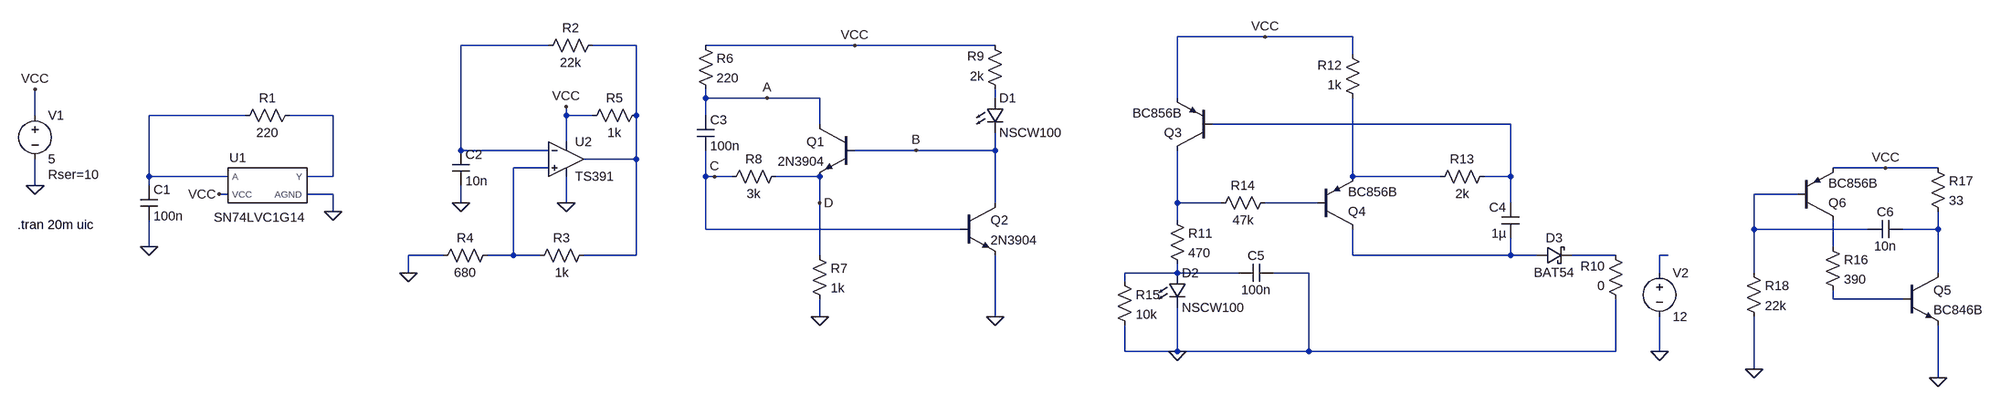
[diagram p0: schematic relaxation_oscillator.asc]
relaxation_oscillator.asc, the LTspice schematic file:
Version 4
SHEET 1 3896 1076
WIRE 2128 -80 1968 -80
WIRE 2288 -80 2128 -80
WIRE 784 -64 624 -64
WIRE 944 -64 864 -64
WIRE 1376 -64 1104 -64
WIRE 1632 -64 1376 -64
WIRE 2288 -48 2288 -80
WIRE 1104 32 1104 16
WIRE 1216 32 1104 32
WIRE 1312 32 1216 32
WIRE 1632 32 1632 16
WIRE 1968 32 1968 -80
WIRE -160 64 -160 16
WIRE 224 64 48 64
WIRE 384 64 304 64
WIRE 816 64 816 48
WIRE 864 64 816 64
WIRE 944 64 944 -64
WIRE 1104 64 1104 32
WIRE 1312 80 1312 32
WIRE 2576 80 2032 80
WIRE 816 112 816 64
WIRE 624 128 624 -64
WIRE 784 128 624 128
WIRE 1488 128 1376 128
WIRE 1632 128 1632 96
WIRE 1632 128 1488 128
WIRE 944 144 944 64
WIRE 944 144 848 144
WIRE 784 160 720 160
WIRE 3712 160 3616 160
WIRE 3808 160 3712 160
WIRE 48 176 48 64
WIRE 192 176 48 176
WIRE 384 176 384 64
WIRE 384 176 336 176
WIRE 1104 176 1104 128
WIRE 1120 176 1104 176
WIRE 1152 176 1120 176
WIRE 1312 176 1232 176
WIRE 2288 176 2288 32
WIRE 2448 176 2288 176
WIRE 2576 176 2576 80
WIRE 2576 176 2528 176
WIRE -160 192 -160 144
WIRE 48 192 48 176
WIRE 192 208 176 208
WIRE 384 208 336 208
WIRE 3552 208 3472 208
WIRE 624 224 624 192
WIRE 816 224 816 176
WIRE 1312 224 1312 176
WIRE 1632 224 1632 128
WIRE 1968 224 1968 128
WIRE 2048 224 1968 224
WIRE 2224 224 2128 224
WIRE 2576 224 2576 176
WIRE 384 240 384 208
WIRE 1968 256 1968 224
WIRE 1104 272 1104 176
WIRE 1568 272 1104 272
WIRE 3472 272 3472 208
WIRE 3680 272 3472 272
WIRE 3808 272 3808 240
WIRE 3808 272 3744 272
WIRE 48 304 48 256
WIRE 3616 304 3616 256
WIRE 592 320 528 320
WIRE 720 320 720 160
WIRE 720 320 672 320
WIRE 768 320 720 320
WIRE 944 320 944 144
WIRE 944 320 848 320
WIRE 1312 320 1312 224
WIRE 2288 320 2288 272
WIRE 2576 320 2576 288
WIRE 2576 320 2288 320
WIRE 2624 320 2576 320
WIRE 2768 320 2688 320
WIRE 2864 320 2848 320
WIRE 528 352 528 320
WIRE 1968 352 1968 336
WIRE 1968 352 1872 352
WIRE 2080 352 1968 352
WIRE 2208 352 2144 352
WIRE 2848 352 2848 320
WIRE 3472 352 3472 272
WIRE 3808 352 3808 272
WIRE 1872 368 1872 352
WIRE 3616 400 3616 384
WIRE 3744 400 3616 400
WIRE 1312 432 1312 400
WIRE 1632 432 1632 320
WIRE 1872 496 1872 448
WIRE 1968 496 1968 416
WIRE 1968 496 1872 496
WIRE 2208 496 2208 352
WIRE 2208 496 1968 496
WIRE 2768 496 2768 400
WIRE 2768 496 2208 496
WIRE 2848 496 2848 432
WIRE 3472 528 3472 432
WIRE 3808 544 3808 448
FLAG -160 192 0
FLAG -160 16 VCC
FLAG 176 208 VCC
FLAG 48 304 0
FLAG 384 240 0
FLAG 816 224 0
FLAG 816 48 VCC
FLAG 624 224 0
FLAG 528 352 0
FLAG 1632 432 0
FLAG 1376 -64 VCC
FLAG 1312 432 0
FLAG 1216 32 A
FLAG 1488 128 B
FLAG 1120 176 C
FLAG 1312 224 D
FLAG 1968 496 0
FLAG 2128 -80 VCC
FLAG 2848 496 0
FLAG 3472 528 0
FLAG 3808 544 0
FLAG 3712 160 VCC
SYMBOL voltage -160 48 R0
WINDOW 123 0 0 Left 0
WINDOW 39 24 124 Left 2
SYMATTR InstName V1
SYMATTR Value 5
SYMATTR SpiceLine Rser=10
SYMBOL res 320 48 R90
WINDOW 0 0 56 VBottom 2
WINDOW 3 32 56 VTop 2
SYMATTR InstName R1
SYMATTR Value 220
SYMBOL cap 32 192 R0
SYMATTR InstName C1
SYMATTR Value 100n
SYMBOL AutoGenerated\\SN74LVC1G14 240 192 R0
WINDOW 0 -30 -35 Bottom 2
SYMATTR InstName U1
SYMBOL Parts_TCO\\TS391 816 80 R0
SYMATTR InstName U2
SYMBOL res 880 -80 R90
WINDOW 0 0 56 VBottom 2
WINDOW 3 32 56 VTop 2
SYMATTR InstName R2
SYMATTR Value 22k
SYMBOL cap 608 128 R0
SYMATTR InstName C2
SYMATTR Value 10n
SYMBOL res 864 304 R90
WINDOW 0 0 56 VBottom 2
WINDOW 3 32 56 VTop 2
SYMATTR InstName R3
SYMATTR Value 1k
SYMBOL res 688 304 R90
WINDOW 0 0 56 VBottom 2
WINDOW 3 32 56 VTop 2
SYMATTR InstName R4
SYMATTR Value 680
SYMBOL res 960 48 R90
WINDOW 0 0 56 VBottom 2
WINDOW 3 32 56 VTop 2
SYMATTR InstName R5
SYMATTR Value 1k
SYMBOL npn 1376 80 M0
SYMATTR InstName Q1
SYMATTR Value 2N3904
SYMBOL npn 1568 224 R0
SYMATTR InstName Q2
SYMATTR Value 2N3904
SYMBOL res 1088 -80 R0
SYMATTR InstName R6
SYMATTR Value 220
SYMBOL res 1648 32 R180
WINDOW 0 36 76 Left 2
WINDOW 3 36 40 Left 2
SYMATTR InstName R9
SYMATTR Value 2k
SYMBOL cap 1088 64 R0
SYMATTR InstName C3
SYMATTR Value 100n
SYMBOL LED 1616 32 R0
SYMATTR InstName D1
SYMATTR Value NSCW100
SYMATTR Description Diode
SYMATTR Type diode
SYMBOL res 1296 304 R0
SYMATTR InstName R7
SYMATTR Value 1k
SYMBOL res 1248 160 R90
WINDOW 0 0 56 VBottom 2
WINDOW 3 32 56 VTop 2
SYMATTR InstName R8
SYMATTR Value 3k
SYMBOL res 2784 416 R180
WINDOW 0 36 76 Left 2
WINDOW 3 36 40 Left 2
SYMATTR InstName R10
SYMATTR Value 0
SYMBOL res 1952 240 R0
SYMATTR InstName R11
SYMATTR Value 470
SYMBOL cap 2592 288 R180
WINDOW 0 24 56 Left 2
WINDOW 3 24 8 Left 2
SYMATTR InstName C4
SYMATTR Value 1µ
SYMBOL LED 1952 352 R0
SYMATTR InstName D2
SYMATTR Value NSCW100
SYMATTR Description Diode
SYMATTR Type diode
SYMBOL res 2304 48 R180
WINDOW 0 36 76 Left 2
WINDOW 3 36 40 Left 2
SYMATTR InstName R12
SYMATTR Value 1k
SYMBOL res 2432 192 R270
WINDOW 0 32 56 VTop 2
WINDOW 3 0 56 VBottom 2
SYMATTR InstName R13
SYMATTR Value 2k
SYMBOL pnp 2032 128 R180
SYMATTR InstName Q3
SYMATTR Value BC856B
SYMBOL pnp 2224 272 M180
SYMATTR InstName Q4
SYMATTR Value BC856B
SYMBOL voltage 2848 336 R0
SYMATTR InstName V2
SYMATTR Value 12
SYMBOL schottky 2624 336 R270
WINDOW 0 32 32 VTop 2
WINDOW 3 0 32 VBottom 2
SYMATTR InstName D3
SYMATTR Value BAT54
SYMATTR Description Diode
SYMATTR Type diode
SYMBOL cap 2144 336 R90
WINDOW 0 0 32 VBottom 2
WINDOW 3 32 32 VTop 2
SYMATTR InstName C5
SYMATTR Value 100n
SYMBOL res 2144 208 R90
WINDOW 0 0 56 VBottom 2
WINDOW 3 32 56 VTop 2
SYMATTR InstName R14
SYMATTR Value 47k
SYMBOL res 1856 352 R0
SYMATTR InstName R15
SYMATTR Value 10k
SYMBOL npn 3744 352 R0
SYMATTR InstName Q5
SYMATTR Value BC846B
SYMBOL pnp 3552 256 M180
SYMATTR InstName Q6
SYMATTR Value BC856B
SYMBOL res 3600 288 R0
SYMATTR InstName R16
SYMATTR Value 390
SYMBOL res 3792 144 R0
SYMATTR InstName R17
SYMATTR Value 33
SYMBOL res 3456 336 R0
SYMATTR InstName R18
SYMATTR Value 22k
SYMBOL cap 3744 256 R90
WINDOW 0 0 32 VBottom 2
WINDOW 3 32 32 VTop 2
SYMATTR InstName C6
SYMATTR Value 10n
TEXT -192 264 Left 2 !.tran 20m uic

The netlist it stands for:
* relaxation_oscillator.asc
V1 VCC 0 5 Rser=10
R1 N005 N004 220
C1 N004 0 100n
XU1 N005 N004 VCC 0 SN74LVC1G14  ; pins Y A VCC AGND
* U2: TS391 (symbol Parts_TCO\TS391 not available, pins judged from their places): In+=N007 In-=N001 V+=VCC V-=0 OUT=N002
R2 N002 N001 22k
C2 N001 0 10n
R3 N002 N007 1k
R4 N007 0 680
R5 N002 VCC 1k
Q1 A B D 0 2N3904
Q2 B C 0 0 2N3904
R6 VCC A 220
R9 N003 VCC 2k
C3 A C 100n
D1 N003 B NSCW100
R7 D 0 1k
R8 D C 3k
R10 0 N015 0
R11 N010 N017 470
C4 N014 N006 1µ
D2 N017 0 NSCW100
R12 N008 VCC 1k
R13 N008 N006 2k
Q3 N010 N006 VCC 0 BC856B
Q4 N014 N011 N008 0 BC856B
V2 N016 0 12
D3 N014 N015 BAT54
C5 0 N017 100n
R14 N011 N010 47k
R15 N017 0 10k
Q5 N012 N018 0 0 BC846B
Q6 N013 N009 VCC 0 BC856B
R16 N013 N018 390
R17 VCC N012 33
R18 N009 0 22k
C6 N012 N009 10n
.model D D
.lib standard.dio
.model NPN NPN
.model PNP PNP
.lib standard.bjt
.tran 20m uic
.lib SN74LVC1G14.cir
.backanno
.end